# Altium schematic sheet ZYNQ_CONFIG.SchDoc
size A4; DocumentNumber: 2; SheetNumber: 2; SheetTotal: 47
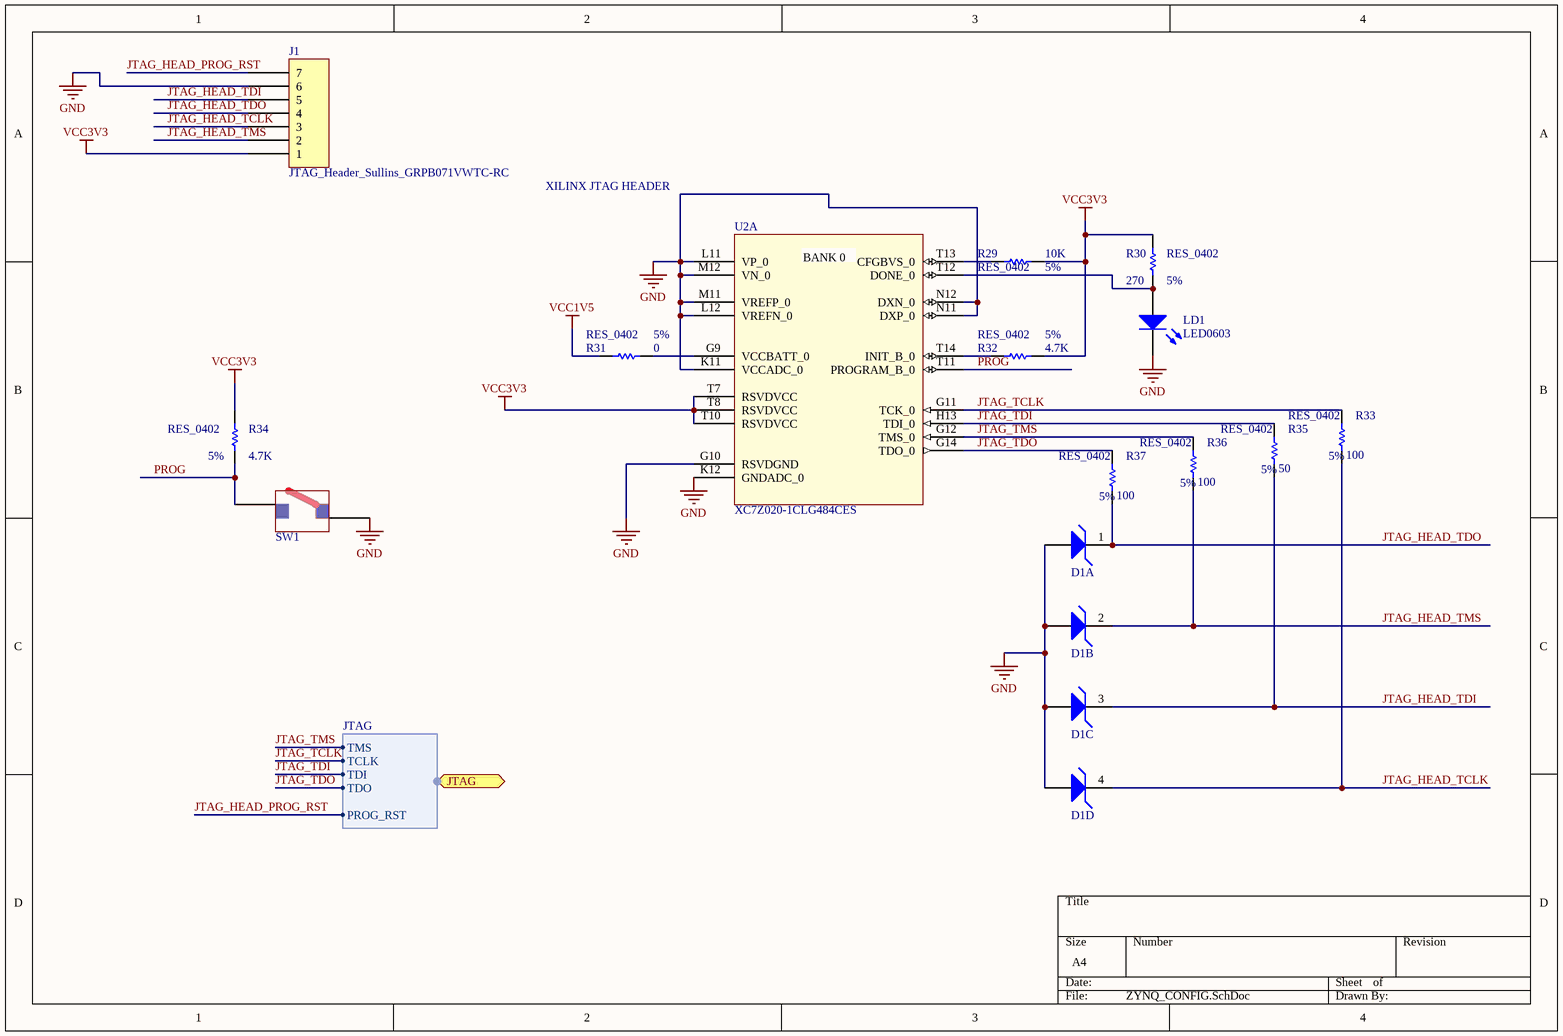
[diagram p0: ZYNQ_CONFIG.SchDoc]

## Parts
D1  QuadESDDiode_TEConnectivity_SESD0802Q4UG  [QuadESDDiode_TEConnectivity_SESD0802Q4UG_5-PIN]  (value not drawn)  (parts A,B,C,D of 4)
J1  JTAG_Header_Sullins_GRPB071VWTC-RC  [JTAG_Header_Sullins_GRPB071VWTC-RC_7-Pos]
LD1  LED0603  [LED0603(1608)]
R29  RES_0402  value 10K  Tolerance: 5%  [RESC0402(1005)_N]
R30  RES_0402  value 270  Tolerance: 5%  [RESC0402(1005)_N]
R31  RES_0402  value 0  Tolerance: 5%  [RESC0402(1005)_N]
R32  RES_0402  value 4.7K  Tolerance: 5%  [RESC0402(1005)_N]
R33  RES_0402  value 100  Tolerance: 5%  [RESC0402(1005)_N]
R34  RES_0402  value 4.7K  Tolerance: 5%  [RESC0402(1005)_N]
R35  RES_0402  value 50  Tolerance: 5%  [RESC0402(1005)_N]
R36  RES_0402  value 100  Tolerance: 5%  [RESC0402(1005)_N]
R37  RES_0402  value 100  Tolerance: 5%  [RESC0402(1005)_N]
SW1  CHS-01TB  [DIP_Switch_SPST_CopalElectronics_CHS-01TB]  (value not drawn)
U2  XC7Z020-1CLG484CES  [ZYNQ_xc7z020clg484pkg_BGA-484]  (part A of 10)

## Ports
JTAG (harness JTAG)

## Harnesses
JTAG: TMS, TCLK, TDI, TDO, PROG_RST

## Nets
GND: D1.G(A) J1.6 LD1.1(K) SW1.2 U2.G10(RSVDGND) U2.K11(VCCADC_0) U2.K12(GNDADC_0) U2.L11(VP_0) U2.L12(VREFN_0) U2.M11(VREFP_0) U2.M12(VN_0) U2.N11(DXP_0) U2.N12(DXN_0)
VCC1V5: R31.1
VCC3V3: J1.1 R29.2 R30.2 R32.2 R34.2 U2.T7(RSVDVCC) U2.T8(RSVDVCC) U2.T10(RSVDVCC)
JTAG_HEAD_PROG_RST: J1.7 ; port JTAG.PROG_RST
JTAG_HEAD_TCLK: D1.4(K) J1.3 R33.1
JTAG_HEAD_TDI: D1.3(K) J1.5 R35.1
JTAG_HEAD_TDO: D1.1(K) J1.4 R37.1
JTAG_HEAD_TMS: D1.2(K) J1.2 R36.1
JTAG_TCLK: R33.2 U2.G11(TCK_0) ; port JTAG.TCLK
JTAG_TDI: R35.2 U2.H13(TDI_0) ; port JTAG.TDI
JTAG_TDO: R37.2 U2.G14(TDO_0) ; port JTAG.TDO
JTAG_TMS: R36.2 U2.G12(TMS_0) ; port JTAG.TMS
PROG: R34.1 SW1.1 U2.T11(PROGRAM_B_0)
NetLD1_2: LD1.2(A) R30.1 U2.T12(DONE_0)
NetR29_1: R29.1 U2.T13(CFGBVS_0)
NetR31_2: R31.2 U2.G9(VCCBATT_0)
NetR32_1: R32.1 U2.T14(INIT_B_0)

## Notes on the sheet
- XILINX JTAG HEADER
- (in symbol XC7Z020-1CLG484CES, part A) BANK 0

## Library data of the parts
D1 = RF2197-000: SESD0802Q4UG, Quad Diode Array for ESD protection; Part Number: RF2197-000; Manufacturer: TE Connectivity
J1 = GRPB071VWTC-RC: CONN HEADER .050" 7POS SMD GOLD; Manufacturer: Sullins Connector Solutions; Part Number: GRPB071VWTC-RC
LD1 = LED0603: LED 565NM GRN DIFF 0603 SMD; Part Number: SML-LX0603GW-TR; Manufacturer: Lumex Opto/Components Inc; Value: GREEN; Footprint Ref: LED0603(1608); Library Ref: LED0603
R29 = RES_0402: 10K ohm, 5%, 1/16W, 0402; Part Number: RC0402JR-0710KL; Manufacturer: Yageo America; Library Ref: RES_0402; Footprint Ref: RESC0402(1005)_N
R30 = RES_0402: 270 ohm, 5%, 1/16W, 0402; Part Number: RC0402JR-07270RL; Manufacturer: Yageo America; Library Ref: RES_0402; Footprint Ref: RESC0402(1005)_N
R31 = RES_0402: 0.0 ohm shunt, 5%, 1/16W, 0402; Part Number: RC0402JR-070RL; Manufacturer: Yageo America; Library Ref: RES_0402; Footprint Ref: RESC0402(1005)_N
R32 R34 = RES_0402: 4.7K ohm, 5%, 1/16W, 0402; Part Number: RC0402JR-074K7L; Manufacturer: Yageo America; Library Ref: RES_0402; Footprint Ref: RESC0402(1005)_N
R33 R36 R37 = RES_0402: 100 ohm, 5%, 1/16W, 0402; Part Number: RC0402JR-07100RL; Manufacturer: Yageo America; Library Ref: RES_0402; Footprint Ref: RESC0402(1005)_N
R35 = RES_0402: 50 ohm, 5% 50mW, 0402; Part Number: FC0402E50R0JTBST1; Manufacturer: VISHAY SILICONIX; Library Ref: RES_0402; Footprint Ref: RESC0402(1005)_N
SW1 = CHS-01TB: SWITCH DIP 1-POS SLIDE SMD; Manufacturer: Copal Electronics Inc; Part Number: CHS-01TB
U2 = XC7Z020-1CLG484CES: XC7Z020-1CLG484CES, Zynq-7000 All Programmable SoC; Manufacturer: Xilinx; Part Number: XC7Z020-1CLG484CES